# EAGLE design BBBMS rev 2 (EAGLE 6.3)

## Sheet 1 of 5
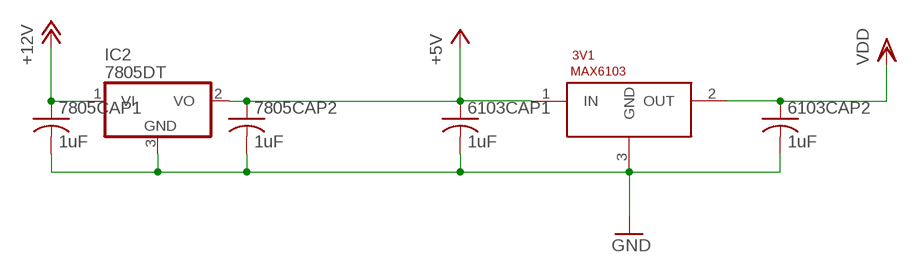
[diagram p0: schematic, sheet 1]

### Parts
3V1  MAX6103  [SOT23]
6103CAP1  1uF  C-USC1206  [C1206]
6103CAP2  1uF  C-USC1206  [C1206]
7805CAP1  1uF  C-USC1206  [C1206]
7805CAP2  1uF  C-USC1206  [C1206]
IC2  7805DT  [TO252]

### Nets
5V: 3V1.1(IN) 6103CAP1.1 7805CAP2.1 IC2.2(VO) ; supply symbol labelled +5V ; also sheet 5
12V: 7805CAP1.1 IC2.1(VI) ; supply symbol labelled +12V ; also sheet 2,3,4,5
GND: 3V1.3(GND) 6103CAP1.2 6103CAP2.2 7805CAP1.2 7805CAP2.2 IC2.3(GND) ; also sheet 2,3,4,5
VREF: 3V1.2(OUT) 6103CAP2.1 ; supply symbol labelled VDD ; also sheet 2,3

## Sheet 2 of 5
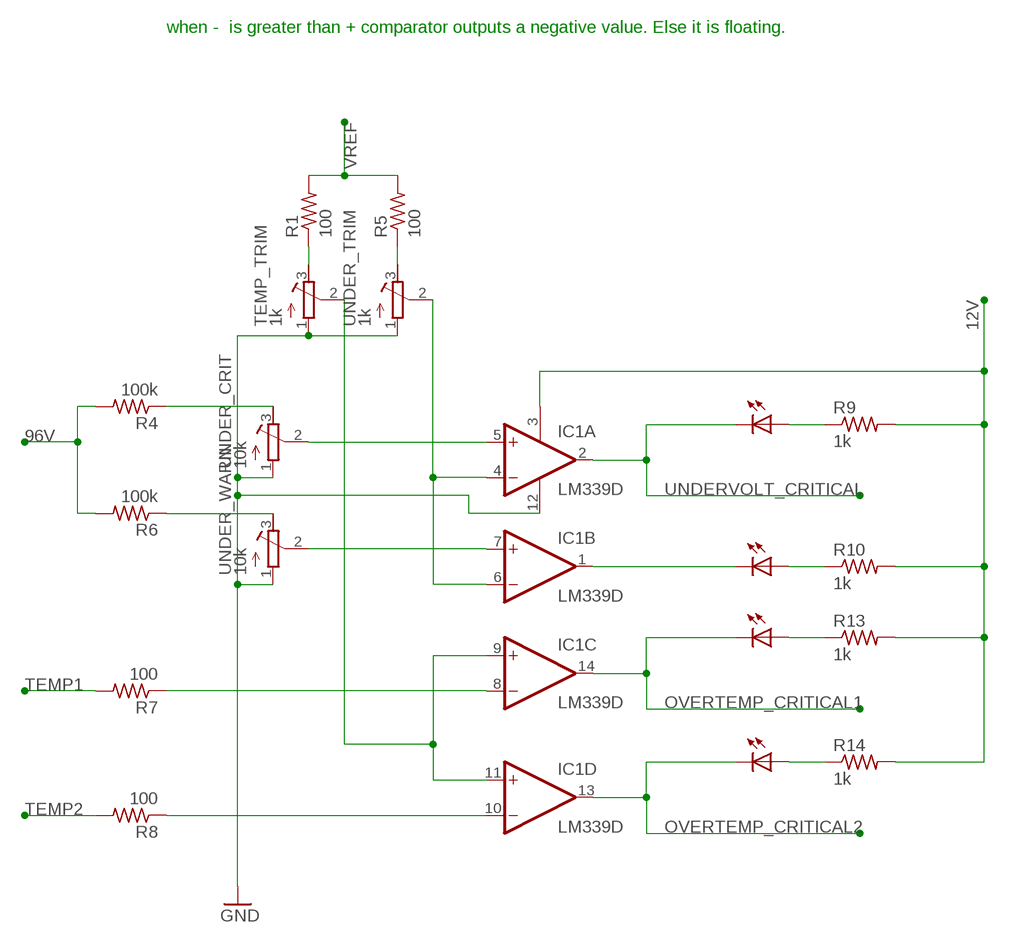
[diagram p1: schematic, sheet 2]

### Parts
IC1  LM339D  [SO14]
OVERTEMP1  LEDCHIPLED_1206  [CHIPLED_1206]
OVERTEMP2  LEDCHIPLED_1206  [CHIPLED_1206]
R1  100  R-US_R1206  [R1206]
R4  100k  R-US_R1206  [R1206]
R5  100  R-US_R1206  [R1206]
R6  100k  R-US_R1206  [R1206]
R7  100  R-US_R1206  [R1206]
R8  100  R-US_R1206  [R1206]
R9  1k  R-US_R1206  [R1206]
R10  1k  R-US_R1206  [R1206]
R13  1k  R-US_R1206  [R1206]
R14  1k  R-US_R1206  [R1206]
TEMP_TRIM  1k  R-TRIMMTS63Y  [RTRIMTS63Y]
UNDER_CRIT  10k  R-TRIMMTS63Y  [RTRIMTS63Y]
UNDER_TRIM  1k  R-TRIMMTS63Y  [RTRIMTS63Y]
UNDER_WARN  10k  R-TRIMMTS63Y  [RTRIMTS63Y]
UNDERVOLT  LEDCHIPLED_1206  [CHIPLED_1206]
UNDERVOLT_WARN  LEDCHIPLED_1206  [CHIPLED_1206]

### Nets
12V: IC1.3(P:V+) R9.2 R10.2 R13.2 R14.2 ; also sheet 1,3,4,5
96V: R4.2 R6.2 ; also sheet 3,5
GND: IC1.12(P:GND) TEMP_TRIM.1(A) UNDER_CRIT.1(A) UNDER_TRIM.1(A) UNDER_WARN.1(A) ; also sheet 1,3,4,5
N$2: IC1.8(C:-IN) R7.1
N$3: IC1.7(B:+IN) UNDER_WARN.2(S)
N$4: IC1.5(A:+IN) UNDER_CRIT.2(S)
N$5: IC1.9(C:+IN) IC1.11(D:+IN) TEMP_TRIM.2(S)
N$6: R6.1 UNDER_WARN.3(E)
N$8: IC1.10(D:-IN) R8.1
N$9: R4.1 UNDER_CRIT.3(E)
N$10: IC1.4(A:-IN) IC1.6(B:-IN) UNDER_TRIM.2(S)
N$11: R5.1 UNDER_TRIM.3(E)
N$12: R1.1 TEMP_TRIM.3(E)
N$14: R9.1 UNDERVOLT.A
N$15: R10.1 UNDERVOLT_WARN.A
N$16: OVERTEMP1.A R13.1
N$17: OVERTEMP2.A R14.1
OVERTEMP_CRITICAL1: IC1.14(C:OUT) OVERTEMP1.C ; also sheet 4
OVERTEMP_CRITICAL2: IC1.13(D:OUT) OVERTEMP2.C ; also sheet 4
TEMP1: R7.2 ; also sheet 5
TEMP2: R8.2 ; also sheet 5
UNDERVOLT_CRITICAL: IC1.2(A:OUT) UNDERVOLT.C ; also sheet 4
UNDERVOLT_WARNING: IC1.1(B:OUT) UNDERVOLT_WARN.C
VREF: R1.2 R5.2 ; also sheet 1,3

### Notes on the sheet
- when -  is greater than + comparator outputs a negative value. Else it is floating.

## Sheet 3 of 5
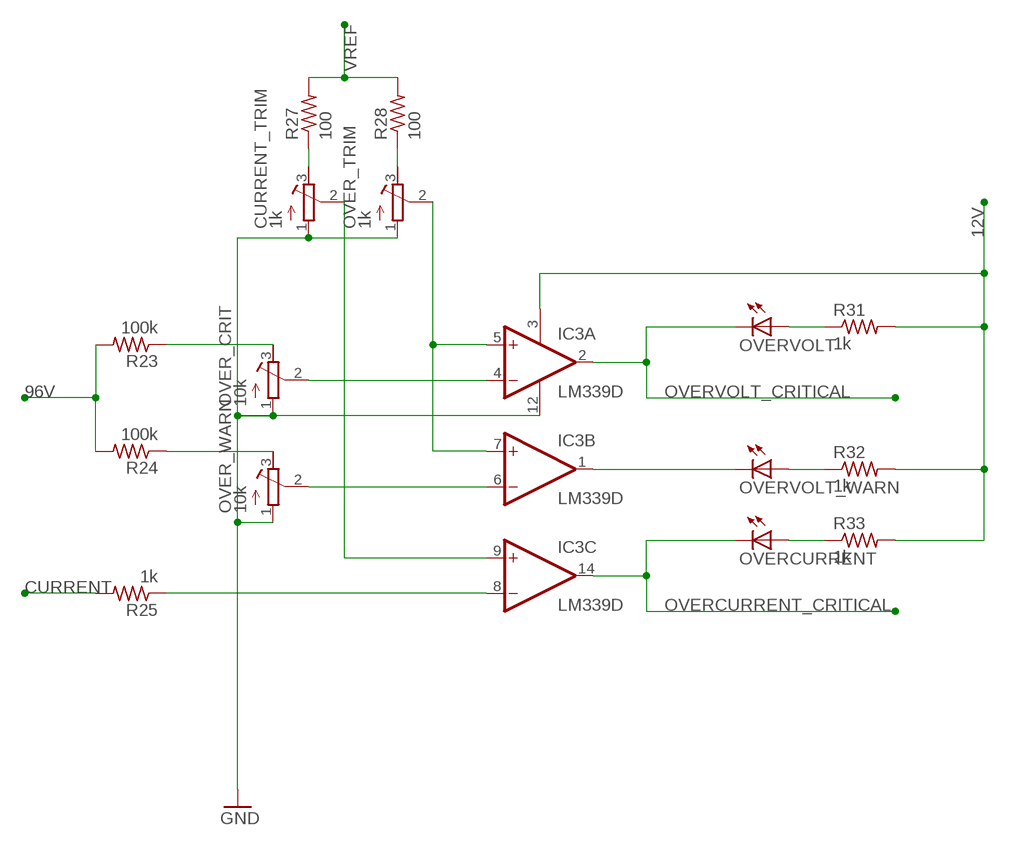
[diagram p2: schematic, sheet 3]

### Parts
CURRENT_TRIM  1k  R-TRIMMTS63Y  [RTRIMTS63Y]
IC3  LM339D  [SO14]
OVER_CRIT  10k  R-TRIMMTS63Y  [RTRIMTS63Y]
OVER_TRIM  1k  R-TRIMMTS63Y  [RTRIMTS63Y]
OVER_WARN  10k  R-TRIMMTS63Y  [RTRIMTS63Y]
OVERCURRENT  LEDCHIPLED_1206  [CHIPLED_1206]
OVERVOLT  LEDCHIPLED_1206  [CHIPLED_1206]
OVERVOLT_WARN  LEDCHIPLED_1206  [CHIPLED_1206]
R23  100k  R-US_R1206  [R1206]
R24  100k  R-US_R1206  [R1206]
R25  1k  R-US_R1206  [R1206]
R27  100  R-US_R1206  [R1206]
R28  100  R-US_R1206  [R1206]
R31  1k  R-US_R1206  [R1206]
R32  1k  R-US_R1206  [R1206]
R33  1k  R-US_R1206  [R1206]

### Nets
12V: IC3.3(P:V+) R31.2 R32.2 R33.2 ; also sheet 1,2,4,5
96V: R23.2 R24.2 ; also sheet 2,5
CURRENT: R25.2 ; also sheet 5
GND: CURRENT_TRIM.1(A) IC3.12(P:GND) OVER_CRIT.1(A) OVER_TRIM.1(A) OVER_WARN.1(A) ; also sheet 1,2,4,5
N$20: IC3.6(B:-IN) OVER_WARN.2(S)
N$21: IC3.4(A:-IN) OVER_CRIT.2(S)
N$22: CURRENT_TRIM.2(S) IC3.9(C:+IN)
N$23: OVER_CRIT.3(E) R23.1
N$24: OVER_WARN.3(E) R24.1
N$25: IC3.8(C:-IN) R25.1
N$27: IC3.5(A:+IN) IC3.7(B:+IN) OVER_TRIM.2(S)
N$28: OVER_TRIM.3(E) R28.1
N$29: CURRENT_TRIM.3(E) R27.1
N$30: OVERVOLT.A R31.1
N$31: OVERVOLT_WARN.A R32.1
N$32: OVERCURRENT.A R33.1
OVERCURRENT_CRITICAL: IC3.14(C:OUT) OVERCURRENT.C ; also sheet 4
OVERVOLT_CRITICAL: IC3.2(A:OUT) OVERVOLT.C ; also sheet 4
OVERVOLT_WARNING1: IC3.1(B:OUT) OVERVOLT_WARN.C
VREF: R27.2 R28.2 ; also sheet 1,2
Unconnected: IC3.10(D:-IN) IC3.11(D:+IN) IC3.13(D:OUT)

## Sheet 4 of 5
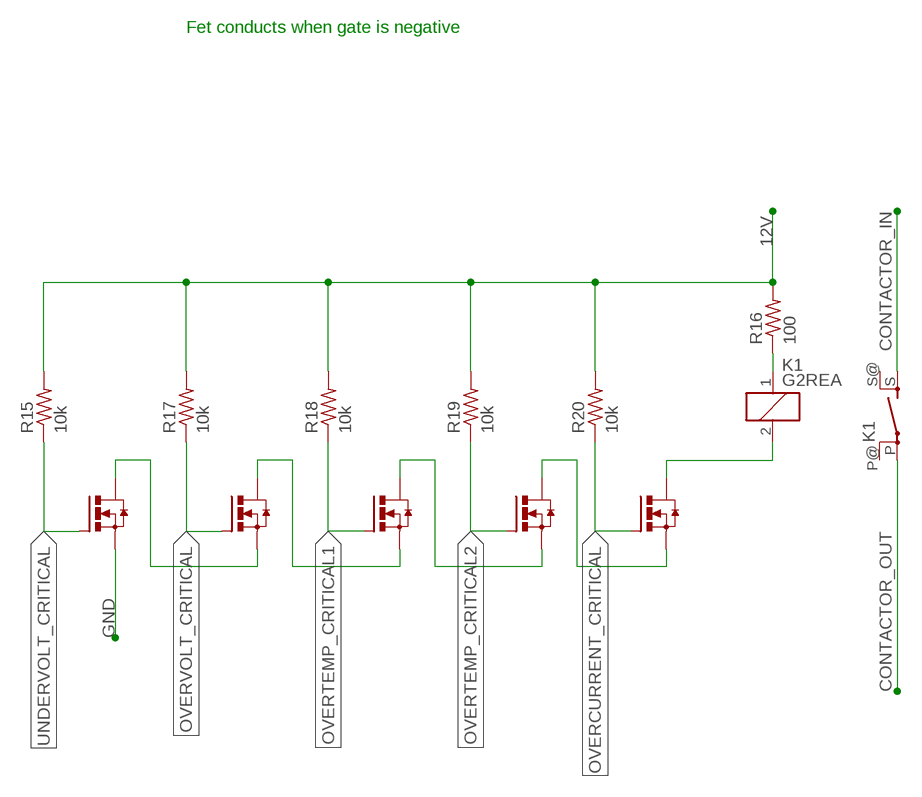
[diagram p3: schematic, sheet 4]

### Parts
K1  G2REA  [G2REA]
OVERCURRENT_FET  N-HEXFET-2D_SOT232-  [SOT223]
OVERTEMP1_FET  N-HEXFET-2D_SOT232-  [SOT223]
OVERTEMP2_FET  N-HEXFET-2D_SOT232-  [SOT223]
OVERVOLT_FET  N-HEXFET-2D_SOT232-  [SOT223]
R15  10k  R-US_R1206  [R1206]
R16  100  R-US_R1206  [R1206]
R17  10k  R-US_R1206  [R1206]
R18  10k  R-US_R1206  [R1206]
R19  10k  R-US_R1206  [R1206]
R20  10k  R-US_R1206  [R1206]
UNDERVOLT_FET  N-HEXFET-2D_SOT232-  [SOT223]

### Nets
12V: R15.2 R16.2 R17.2 R18.2 R19.2 R20.2 ; also sheet 1,2,3,5
CONTACTOR_IN: K1.S(2:S) ; also sheet 5
CONTACTOR_OUT: K1.P(2:P) ; also sheet 5
GND: UNDERVOLT_FET.3(S) ; also sheet 1,2,3,5
N$1: K1.2 OVERCURRENT_FET.2(D) OVERCURRENT_FET.4(D)
N$7: OVERCURRENT_FET.3(S) OVERTEMP2_FET.2(D) OVERTEMP2_FET.4(D)
N$13: K1.1 R16.1
N$18: OVERTEMP1_FET.2(D) OVERTEMP1_FET.4(D) OVERTEMP2_FET.3(S)
N$19: OVERTEMP1_FET.3(S) OVERVOLT_FET.2(D) OVERVOLT_FET.4(D)
N$26: OVERVOLT_FET.3(S) UNDERVOLT_FET.2(D) UNDERVOLT_FET.4(D)
OVERCURRENT_CRITICAL: OVERCURRENT_FET.1(G) R20.1 ; also sheet 3
OVERTEMP_CRITICAL1: OVERTEMP1_FET.1(G) R18.1 ; also sheet 2
OVERTEMP_CRITICAL2: OVERTEMP2_FET.1(G) R19.1 ; also sheet 2
OVERVOLT_CRITICAL: OVERVOLT_FET.1(G) R17.1 ; also sheet 3
UNDERVOLT_CRITICAL: R15.1 UNDERVOLT_FET.1(G) ; also sheet 2
Unconnected: K1.P@(2:P) K1.S@(2:S)

### Notes on the sheet
- Fet conducts when gate is negative

## Sheet 5 of 5
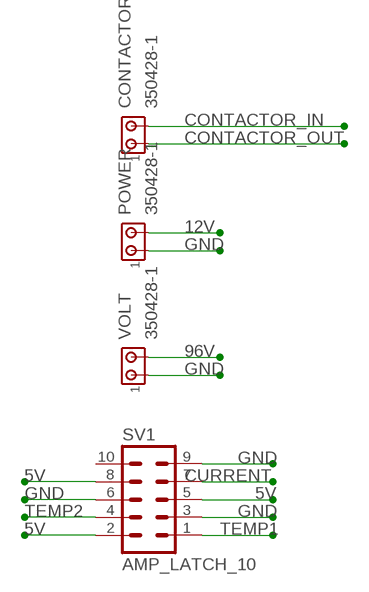
[diagram p4: schematic, sheet 5]

### Parts
CONTACTOR  350428-1  [350428-1]
POWER  350428-1  [350428-1]
SV1  AMP_LATCH_10  [MA05-2]
VOLT  350428-1  [350428-1]

### Nets
5V: SV1.2 SV1.5 SV1.8 ; also sheet 1
12V: POWER.2 ; also sheet 1,2,3,4
96V: VOLT.2 ; also sheet 2,3
CONTACTOR_IN: CONTACTOR.2 ; also sheet 4
CONTACTOR_OUT: CONTACTOR.1 ; also sheet 4
CURRENT: SV1.7 ; also sheet 3
GND: POWER.1 SV1.3 SV1.6 SV1.9 VOLT.1 ; also sheet 1,2,3,4
TEMP1: SV1.1 ; also sheet 2
TEMP2: SV1.4 ; also sheet 2
Unconnected: SV1.10

## Library data of the parts
3V1 = SolarJacketsADC:MAX6103
6103CAP1 6103CAP2 7805CAP1 7805CAP2 = rcl:C-US: CAPACITOR, American symbol
CONTACTOR POWER VOLT = con-amp:350428-1: Universal MATE-N-LOK .250" Centerline, 600 V, 19 - 36 A max Source: http://catalog.tycoelectronics.com/ .. ENG_CD_350428_Y.pdf
CURRENT_TRIM OVER_CRIT OVER_TRIM OVER_WARN TEMP_TRIM UNDER_CRIT UNDER_TRIM UNDER_WARN = rcl:R-TRIMM: Trimm resistor
IC1 IC3 = linear:LM339: Low Power Low Offset Voltage Quad Comparators with open collector; LM139/LM239/LM339/LM2901/LM3302
IC2 = linear:78*: Positive VOLTAGE REGULATOR Source: http://cache.national.com/ds/LM/LM78L05.pdf http://www.fairchildsemi.com/ds/LM/LM7805.pdf
K1 = relay:G2REA: RELAY 1 x norm. open, high current, Omron; OC_FARNELL: unknown; OC_NEWARK: unknown
OVERCURRENT OVERTEMP1 OVERTEMP2 OVERVOLT OVERVOLT_WARN UNDERVOLT UNDERVOLT_WARN = led:LED: LED OSRAM: - CHIPLED LG R971, LG N971, LY N971, LG Q971, LY Q971, LO R971, LY R971 LH N974, LH R974 LS Q976, LO Q976, LY Q976 LO Q996 - Hyper CHIPLED LW Q18S LB Q993, LB Q99A, LB R99A - SideLED LS A670, LO A670, LY A670, LG A670, LP A670 LB A673, LV A673, LT A673, LW A673 LH A674 LY A675 LS A676, LA A676, LO A676, LY A676, LW A676 LS A679, LY A679, LG A679 - Hyper Micro SIDELED® LS Y876, LA Y876, LO Y876, LY Y876 LT Y87S - SmartLED LW L88C, LW L88S LB L89C, LB L89S, LG L890 LS L89K, LO L89K, LY L89K LS L896, LA L896, LO L896, LY L896 - TOPLED LS T670, LO T670, LY T670, LG T670, LP T670 LSG T670, LSP T670, LSY T670, LOP T670, LYG T670 LG T671, LOG T671, LSG T671 LB T673, LV T673, LT T673, LW T673 LH T674 LS T676, LA T676, LO T676, LY T676, LB T676, LH T676, LSB T676, LW T676 LB T67C, LV T67C, LT T67C, LS T67K, LO T67K, LY T67K, LW E67C LS E67B, LA E67B, LO E67B, LY E67B, LB E67C, LV E67C, LT E67C LW T67C LS T679, LY T679, LG T679 LS T770, LO T770, LY T770, LG T770, LP T770 LB T773, LV T773, LT T773, LW T773 LH T774 LS E675, LA E675, LY E675, LS T675 LS T776, LA T776, LO T776, LY T776, LB T776 LHGB T686 LT T68C, LB T68C - Hyper Mini TOPLED® LB M676 - Mini TOPLED Santana® LG M470 LS M47K, LO M47K, LY M47K Source: http://www.osram.convergy.de LUXEON: - LUMILED® LXK2-PW12-R00, LXK2-PW12-S00, LXK2-PW14-U00, LXK2-PW14-V00 LXK2-PM12-R00, LXK2-PM12-S00, LXK2-PM14-U00 LXK2-PE12-Q00, LXK2-PE12-R00, LXK2-PE12-S00, LXK2-PE14-T00, LXK2-PE14-U00 LXK2-PB12-K00, LXK2-PB12-L00, LXK2-PB12-M00, LXK2-PB14-N00, LXK2-PB14-P00, LXK2-PB14-Q00 LXK2-PR12-L00, LXK2-PR12-M00, LXK2-PR14-Q00, LXK2-PR14-R00 LXK2-PD12-Q00, LXK2-PD12-R00, LXK2-PD12-S00 LXK2-PH12-R00, LXK2-PH12-S00 LXK2-PL12-P00, LXK2-PL12-Q00, LXK2-PL12-R00 Source: www.luxeon.com KINGBRIGHT: KA-3528ASYC Source: www.kingbright.com
OVERCURRENT_FET OVERTEMP1_FET OVERTEMP2_FET OVERVOLT_FET UNDERVOLT_FET = transistor-power:N-HEXFET-2D_?-*: HEXFET® Power MOSFET 2 Drain connects http://www.irf.com/product-info/datasheets/data/irll014n.pdf
R1 R4-R10 R13-R20 R23-R25 R27 R28 R31-R33 = rcl:R-US_: RESISTOR, American symbol
SV1 = SolarJacketsADC:AMP_LATCH_10; PART_NUM: 5499922-1

## Board
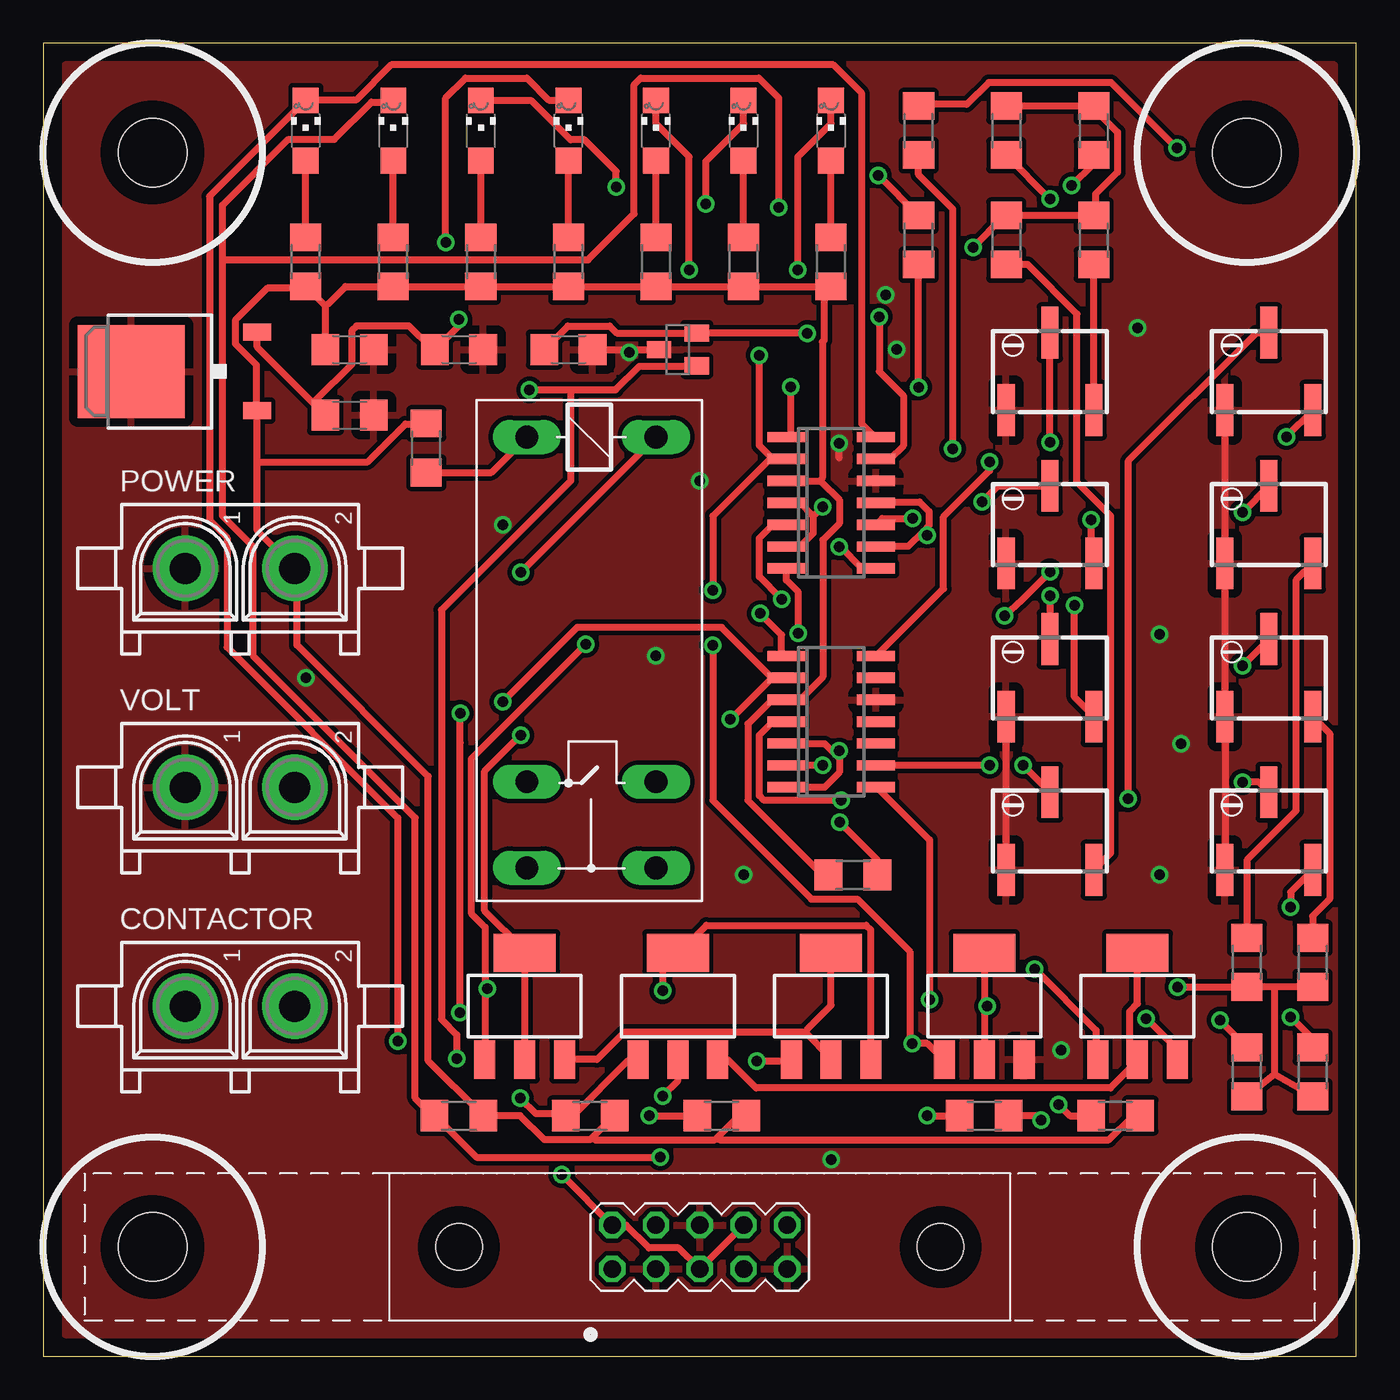
[diagram p5: board, top side]
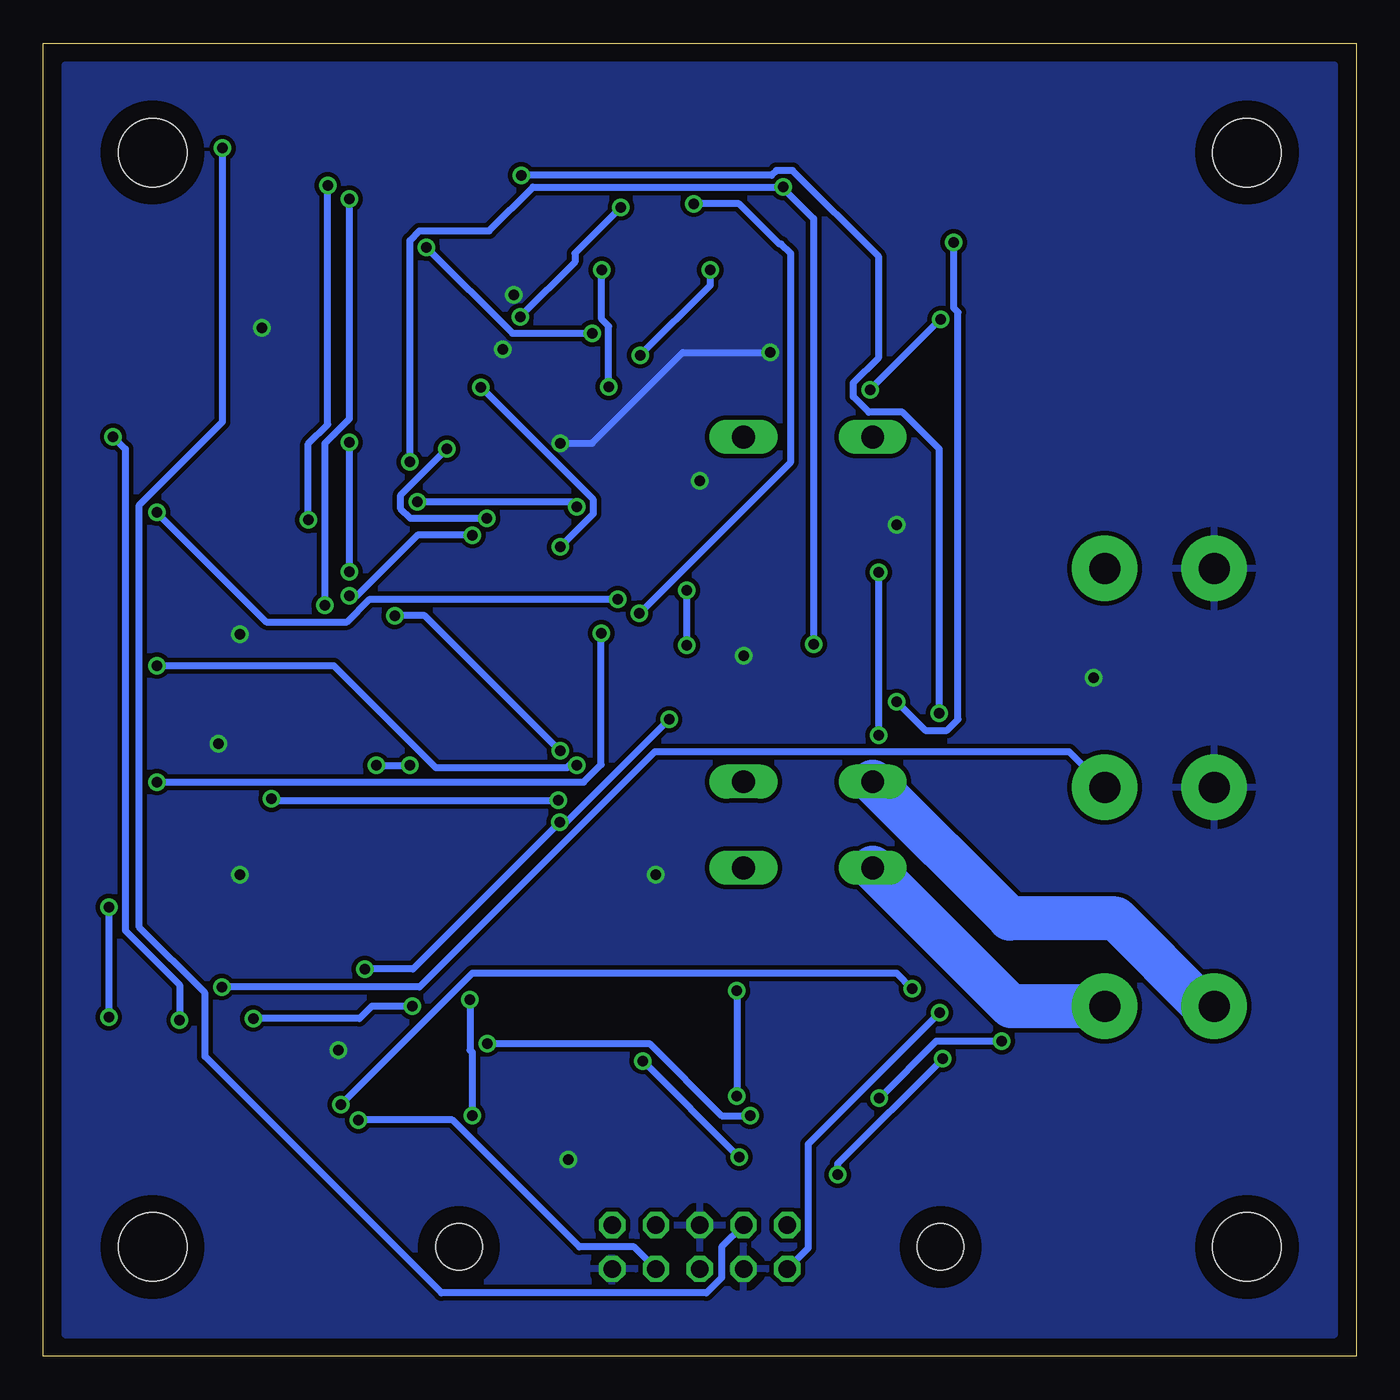
[diagram p6: board, bottom side, seen from below]

Size 76.2 x 76.2 mm. Coordinates in mm from the lower left corner, seen from the top.
Outline: 0,0 76.2,0 76.2,76.2 0,76.2 0,0
Copper layers (1*16): Top 0.035mm / dielectric 1.5mm / Bottom 0.035mm
Design rules "SJ Design Rules": minimum track width 16mil, minimum drill 24mil, track to track 10mil, track to pad 10mil, pad to pad 10mil, via to via 10mil, smd to smd 10mil, copper to edge 40mil, drill to drill 10mil, minimum pad ring 10mil, minimum via ring 8mil, stop-mask expansion 4mil, vias tented up to drill 0mil, thermal gap 20mil
Holes 3.97 mm at 6.35,6.35 69.85,69.85 6.35,69.85 69.85,6.35

### Footprints (pad centres in the part's own frame; a part is rotated, then mirrored left to right if it is on the bottom)
SOT23 = smd 1 x 1.4: 1 -0.95,-1.1; 2 0.95,-1.1; 3 0,1.1
C1206 = smd 1.6 x 1.8: 1 -1.4,0; 2 1.4,0
350428-1 = drill 1.8 pad 3.81: 1 -3.175,0; 2 3.175,0
RTRIMTS63Y = smd 1 x 3: 1 -2.55,-2.25; 2 0,2.25; 3 2.55,-2.25
SO14 = smd 0.6 x 2.2: 1 -3.81,-2.6; 2 -2.54,-2.6; 3 -1.27,-2.6; 4 0,-2.6; 5 1.27,-2.6; 6 2.54,-2.6; 7 3.81,-2.6; 8 3.81,2.6; 9 2.54,2.6; 10 1.27,2.6; 11 0,2.6; 12 -1.27,2.6; 13 -2.54,2.6; 14 -3.81,2.6
TO252 = smd 1 x 1.6: 1 -2.28,-4.8; 2 2.28,-4.8 | smd 5.4 x 6.2: 3 0,2.5
G2REA = drill 1.321 long: 1 -2.54,-3.683; 2 -2.54,3.81; P 17.45,-3.683; P@ 17.45,3.81; S 22.454,-3.683; S@ 22.454,3.81
CHIPLED_1206 = smd 1.5 x 1.5: A 0,-1.75; C 0,1.75
SOT223 = smd 1.219 x 2.235: 1 -2.311,-3.099; 2 0,-3.099; 3 2.311,-3.099 | smd 3.6 x 2.2: 4 0,3.099
R1206 = smd 1.6 x 1.803: 1 -1.422,0; 2 1.422,0
MA05-2 = drill 1.016 octagon: 1 -5.08,-1.27; 2 -5.08,1.27; 3 -2.54,-1.27; 4 -2.54,1.27; 5 0,-1.27; 6 0,1.27; 7 2.54,-1.27; 8 2.54,1.27; 9 5.08,-1.27; 10 5.08,1.27 | hole 2.692: -13.97,0; 13.97,0

### Placement (x,y rotation side)
3V1  36.83,58.42 90 top
6103CAP1  24.13,58.42 0 top
6103CAP2  30.48,58.42 0 top
7805CAP1  17.78,58.42 0 top
7805CAP2  17.78,54.61 0 top
CONTACTOR  11.43,20.32 0 top
CURRENT_TRIM  58.42,30.48 0 top
IC1  45.72,49.53 270 top
IC2  7.62,57.15 90 top
IC3  45.72,36.83 270 top
K1  31.75,50.8 270 top
OVER_CRIT  71.12,57.15 0 top
OVER_TRIM  58.42,57.15 0 top
OVER_WARN  71.12,39.37 0 top
OVERCURRENT  25.4,71.12 0 top
OVERCURRENT_FET  27.94,20.32 0 top
OVERTEMP1  15.24,71.12 0 top
OVERTEMP1_FET  36.83,20.32 0 top
OVERTEMP2  20.32,71.12 0 top
OVERTEMP2_FET  45.72,20.32 0 top
OVERVOLT  30.48,71.12 0 top
OVERVOLT_FET  63.5,20.32 0 top
OVERVOLT_WARN  40.64,71.12 0 top
POWER  11.43,45.72 0 top
R1  55.88,71.12 90 top
R4  69.85,22.86 270 top
R5  60.96,71.12 90 top
R6  73.66,16.51 270 top
R7  50.8,64.77 90 top
R8  50.8,71.12 90 top
R9  35.56,63.5 270 top
R10  45.72,63.5 270 top
R13  15.24,63.5 270 top
R14  20.32,63.5 270 top
R15  39.37,13.97 0 top
R16  22.23,52.7 90 top
R17  46.99,27.94 180 top
R18  31.75,13.97 0 top
R19  24.13,13.97 0 top
R20  62.23,13.97 0 top
R23  69.85,16.51 270 top
R24  73.66,22.86 270 top
R25  54.61,13.97 0 top
R27  55.88,64.77 90 top
R28  60.96,64.77 90 top
R31  30.48,63.5 270 top
R32  40.64,63.5 270 top
R33  25.4,63.5 270 top
SV1  38.1,6.35 0 top
TEMP_TRIM  58.42,39.37 0 top
UNDER_CRIT  71.12,48.26 0 top
UNDER_TRIM  58.42,48.26 0 top
UNDER_WARN  71.12,30.48 0 top
UNDERVOLT  35.56,71.12 0 top
UNDERVOLT_FET  54.61,20.32 0 top
UNDERVOLT_WARN  45.72,71.12 0 top
VOLT  11.43,33.02 0 top

### Tracks (layer width: path | path; a pad name or v marks a point on that pad's centre or on a via)
5V  (via drill 0.61)
  Top 0.406: SV1.8 SV1.5 36.88,6.3 35.15,6.3 33.83,7.62 SV1.2 v30.1,10.54 | IC2.2 12.42,59.41 12.42,58.55 16.36,54.61 7805CAP2.1 15.8,55.45 17.91,57.56 17.91,59.51 18.19,59.79 21.23,59.79 22.53,58.5 6103CAP1.1 24.13,59.82 v24.13,60.17 | v28.22,56.08 30.61,56.08 | 30.61,56.08 33.22,56.08 34.59,57.45 37.92,57.45 3V1.1 | v24,17.27 24,18.67 23.11,19.56 23.11,43.31 30.61,50.8 30.61,56.08
  Bottom 0.406: v24.13,60.17 v28.22,56.08 | v30.1,10.54 30.1,11.18 v24,17.27
12V
  Top 0.406: 12.42,51.89 12.42,47.9 POWER.2 14.73,45.59 14.73,41.27 22.35,33.66 22.35,17.14 25.4,14.1 R19.2 27.69,13.97 29.08,12.57 31.75,12.57 31.88,12.7 | 12.42,51.89 IC2.1 12.37,55.07 12.37,57.53 11.15,58.75 11.15,60.12 13.01,61.98 15.06,61.98 R13.2 | 12.42,51.89 18.82,51.89 21.03,54.1 22.23,54.1 R16.2 | 45.11,50.8 46.2,49.71 46.2,48.34 45.24,47.37 45.24,39.42 43.92,38.1 IC3.3 42.29,38.1 40.89,36.7 40.89,32.26 45.21,27.94 R17.2 | IC1.3 45.11,50.8 | 16.36,60.96 16.36,58.42 7805CAP1.1 | R13.2 16.36,60.96 | R13.2 | R14.2 17.55,62.08 16.54,61.06 16.36,60.96 | R14.2 | R33.2 20.5,62.08 R14.2 | R33.2 | R31.2 25.58,62.08 R33.2 | R31.2 | R9.2 30.66,62.08 R31.2 | R9.2 | R32.2 35.74,62.08 R9.2 | R32.2 | R10.2 40.82,62.08 R32.2 | R10.2 | 45.11,50.8 45.21,50.98 45.21,58.85 45.31,58.95 45.31,61.9 R10.2 | 31.88,12.7 33.15,13.97 R18.2 | R15.2 40.39,13.97 39.12,12.7 | 39.12,12.7 38.99,12.57 32,12.57 31.88,12.7 | R20.2 63.25,13.97 61.85,12.57 39.24,12.57 39.12,12.7
96V  (via drill 0.61)
  Top 0.406: R6.2 71.42,16.36 | 71.42,16.36 R23.2 | R23.2 | R6.2 | R24.2 71.42,21.44 | 71.42,21.44 R4.2 | R4.2 | R24.2 | 71.42,21.44 71.42,16.36 | v65.84,21.44 69.67,21.44 R4.2
  Bottom 0.406: v65.84,21.44 54.36,21.44 40.72,35.08 16.66,35.08 VOLT.2
CONTACTOR_IN
  Bottom 2.54: CONTACTOR.2 20.04,20.32 K1.S
CONTACTOR_OUT
  Bottom 2.54: CONTACTOR.1 8.89,20.32 13.97,25.4 20.12,25.4 K1.P
CURRENT  (via drill 0.61)
  Top 0.406: R25.2 57.66,13.97 v57.91,13.72
  Bottom 0.406: v57.91,13.72 52.45,13.72 45.09,6.35 41.91,6.35 SV1.7
GND  (via drill 0.61)
  Top 0.406: 6103CAP2.2 34.01,58.42 | 34.01,58.42 3V1.3 | UNDER_WARN.1 68.58,28.25 OVER_WARN.1 68.58,37.31 UNDER_CRIT.1 68.58,46.2 OVER_CRIT.1 | 55.85,46 UNDER_TRIM.1 | 55.85,37.41 TEMP_TRIM.1 55.88,36.93 55.88,28.42 CURRENT_TRIM.1 | 46.18,52.15 v46.18,52.98 | 47.45,50.88 48.13,50.88 IC1.12 | v34.01,58.24 34.01,58.42
  Bottom 0.406: 43.33,5.21 SV1.9 | v34.01,58.24 39.09,58.24 44.35,52.98 v46.18,52.98
  other vias: 38.1,50.8 35.56,40.64 40.64,27.94 64.77,27.94 63.5,59.69 48.9,61.59 15.24,39.37 45.72,11.43 66.04,35.56 64.77,41.91 26.67,48.26 59.05,17.78 49.53,58.42
  pour Top: 1.27,74.93 1.27,1.27 74.93,1.27 74.93,74.93
  pour Bottom: 1.27,74.93 74.93,74.93 74.93,1.27 1.27,1.27
N$1  (via drill 0.61)
  Top 0.406: OVERCURRENT_FET.2 OVERCURRENT_FET.4 27.86,23.62 25.63,25.86 25.63,33.96 v27.71,36.04 | v27.71,45.49 K1.2
  Bottom 0.406: v27.71,36.04 v27.71,45.49
N$2  (via drill 0.61)
  Top 0.406: v50.8,56.24 R7.1 | v46.2,46.97 46.28,46.97 47.52,45.72 IC1.8
  Bottom 0.406: v50.8,56.24 44.27,49.71 44.27,48.9 v46.2,46.97
N$3  (via drill 0.61)
  Top 0.406: v43.81,41.96 43.81,44.35 43.13,45.03 IC1.7 | v69.6,33.33 70.54,33.33 UNDER_WARN.2
  Bottom 0.406: v43.81,41.96 43.81,34.34 44.83,33.33 v69.6,33.33
N$4  (via drill 0.61)
  Top 0.406: IC1.5 42.34,48.26 41.55,47.47 41.55,45.24 v42.85,43.94 | v69.6,48.97 71.12,50.49 UNDER_CRIT.2
  Bottom 0.406: v42.85,43.94 57.25,43.94 58.57,42.62 63.25,42.62 v69.6,48.97
N$5  (via drill 0.61)
  Top 0.406: IC1.9 50.19,46.99 51.07,47.87 | 51.07,47.87 51.41,48.21 51.41,49.02 50.85,49.58 48.39,49.58 48.34,49.53 IC1.11 | v58.42,44.15 TEMP_TRIM.2 | v51.28,47.65 51.07,47.87
  Bottom 0.406: v58.42,44.15 57.99,44.15 54.48,47.65 v51.28,47.65
N$6  (via drill 0.61)
  Top 0.406: R6.1 73.66,18.41 v72.39,19.68 | v72.39,26.06 72.39,26.95 UNDER_WARN.3
  Bottom 0.406: v72.39,26.06 v72.39,19.68
N$7
  Top 0.406: OVERCURRENT_FET.3 32.13,17.22 33.71,18.8 44.22,18.8 | 44.22,18.8 45.72,17.3 OVERTEMP2_FET.2 | OVERCURRENT_FET.3 | OVERTEMP2_FET.4 45.72,20.37 44.32,18.97 44.22,18.8
N$8  (via drill 0.61)
  Top 0.406: R8.1 50.8,68.56 52.78,66.57 v52.78,52.65 | v50.44,48.62 48.69,48.62 48.34,48.26 IC1.10
  Bottom 0.406: v52.78,52.65 55.45,49.99 55.45,49.17 54.89,48.62 v50.44,48.62
N$9
  Top 0.406: R4.1 69.85,28.8 72.69,31.65 72.69,45.03 UNDER_CRIT.3
N$10  (via drill 0.61)
  Top 0.406: IC1.6 43.92,46.99 44.68,47.75 44.68,48.77 | 44.68,48.77 43.92,49.53 IC1.4 | v54.48,49.58 55.4,50.49 58.42,50.49 UNDER_TRIM.2 | v45.24,49.3 44.83,48.9 44.68,48.77
  Bottom 0.406: v54.48,49.58 45.52,49.58 v45.24,49.3
N$11  (via drill 0.61)
  Top 0.406: R5.1 60.96,69.22 v59.69,67.94 | v60.81,48.54 60.81,46.18 60.96,46.02 UNDER_TRIM.3
  Bottom 0.406: v59.69,67.94 59.69,54.08 60.81,52.96 v60.81,48.54
N$12  (via drill 0.61)
  Top 0.406: v58.42,67.16 R1.1 | v59.84,43.59 59.84,38.25 60.96,37.13 TEMP_TRIM.3 | R1.1
  Bottom 0.406: v58.42,67.16 58.42,54.41 59.84,52.98 v59.84,43.59
N$13
  Top 0.406: R16.1 26.01,51.28 K1.1
N$14
  Top 0.406: R9.1 UNDERVOLT.A
N$15
  Top 0.406: R10.1 UNDERVOLT_WARN.A
N$16
  Top 0.406: R13.1 OVERTEMP1.A
N$17
  Top 0.406: R14.1 OVERTEMP2.A
N$18  (via drill 0.61)
  Top 0.406: OVERTEMP1_FET.2 36.83,16 v35.94,15.11 | v35.94,21.21 35.94,22.48 36.83,23.37 OVERTEMP1_FET.4 36.96,23.5 38.48,25.02 47.75,25.02 48.01,24.77 48.01,17.27 OVERTEMP2_FET.3
  Bottom 0.406: v35.94,21.21 v35.94,15.11
N$19
  Top 0.406: OVERTEMP1_FET.3 39.14,17.2 39.75,17.2 41.38,15.57 61.92,15.57 63.5,17.14 OVERVOLT_FET.2 63.04,16.97 63.04,20.02 63.5,20.47 OVERVOLT_FET.4
N$20  (via drill 0.61)
  Top 0.406: v45.24,34.29 IC3.6 | v69.6,40.08 71.12,41.6 OVER_WARN.2
  Bottom 0.406: v45.24,34.29 45.67,34.29 45.8,34.16 53.42,34.16 59.33,40.08 v69.6,40.08
N$21  (via drill 0.61)
  Top 0.406: IC3.4 42.34,36.83 41.55,36.04 41.55,32.54 41.83,32.26 v46.3,32.26 | v62.94,32.36 62.94,51.94 70.38,59.38 71.12,59.38 OVER_CRIT.2
  Bottom 0.406: v46.3,32.26 62.84,32.26 v62.94,32.36
N$22  (via drill 0.61)
  Top 0.406: v54.91,34.29 IC3.9 | v56.87,34.29 CURRENT_TRIM.2
  Bottom 0.406: v56.87,34.29 v54.91,34.29
N$23  (via drill 0.61)
  Top 0.406: v68.28,19.51 R23.1 | v72.14,53.37 OVER_CRIT.3 | R23.1
  Bottom 0.406: v68.28,19.51 68.28,21.57 71.42,24.71 71.42,52.65 v72.14,53.37
N$24
  Top 0.406: R24.1 73.66,25.55 74.65,26.54 74.65,36.14 73.69,37.11 OVER_WARN.3
N$25  (via drill 0.61)
  Top 0.406: v51.31,13.97 R25.1 | v51.44,20.7 51.44,29.97 48.39,33.02 IC3.8
  Bottom 0.406: v51.31,13.97 51.31,17.65 51.44,17.78 v51.44,20.7
N$26  (via drill 0.61)
  Top 0.406: UNDERVOLT_FET.4 54.61,20.32 | 54.61,20.32 UNDERVOLT_FET.2 | v64.01,19.61 65.79,17.83 65.79,17.22 OVERVOLT_FET.3 | v54.79,20.32 54.61,20.32
  Bottom 0.406: v64.01,19.61 57.84,19.61 57.12,20.32 v54.79,20.32
N$27  (via drill 0.61)
  Top 0.406: IC3.7 45.34,33.02 46.2,33.88 46.2,34.7 45.99,34.91 | 45.99,34.91 45.34,35.56 IC3.5 | v58.42,53.03 OVER_TRIM.2 | v58.42,45.52 56.82,43.92 v55.8,42.98 | v46.2,35.13 45.99,34.91
  Bottom 0.406: v58.42,45.52 v58.42,53.03 | v55.8,42.98 54.05,42.98 v46.2,35.13
N$28
  Top 0.406: R28.1 60.96,54.91 OVER_TRIM.3
N$29
  Top 0.406: R27.1 57.12,63.35 59.99,60.48 59.99,50.72 61.95,48.77 61.95,29.21 60.98,28.25 CURRENT_TRIM.3 | R27.1
N$30
  Top 0.406: R31.1 OVERVOLT.A
N$31
  Top 0.406: R32.1 OVERVOLT_WARN.A
N$32
  Top 0.406: R33.1 OVERCURRENT.A
OVERCURRENT_CRITICAL  (via drill 0.61)
  Top 0.406: v33.25,67.84 33.25,68.76 31.42,70.59 30.61,70.59 28.35,72.85 25.4,72.85 OVERCURRENT.C | v54.91,51.89 54.91,51.38 52.25,48.72 52.25,44.55 48.34,40.64 IC3.14 | 25.65,21.34 25.65,24.89 24.84,25.7 24.84,34.67 v31.5,41.33 | 25.65,21.34 25.65,17.4 OVERCURRENT_FET.1 | R20.1 59.56,13.97 v58.93,14.61 | v25.78,21.34 25.65,21.34
  Bottom 0.406: v54.91,51.89 54.91,64.75 54.36,65.3 50.32,65.3 47.78,67.84 v33.25,67.84 33.15,67.67 31.5,66.02 v31.5,41.33 | v58.93,14.61 51.31,22.23 26.67,22.23 v25.78,21.34
OVERTEMP_CRITICAL1  (via drill 0.61)
  Top 0.406: OVERTEMP1_FET.1 34.42,17.14 33.91,17.14 30.73,13.97 R18.1 30.23,14.1 28.57,14.1 v27.69,14.99 | IC1.14 48.26,53.34 47.5,54.1 47.5,73.28 45.85,74.93 20.19,74.93 18.16,72.9 15.24,72.9 OVERTEMP1.C 15.11,72.77 9.65,67.31 9.65,48.51 10.67,47.5 10.67,41.15 20.57,31.24 v20.57,18.29
  Bottom 0.406: v27.69,14.99 24.38,18.29 v20.57,18.29
OVERTEMP_CRITICAL2  (via drill 0.61)
  Top 0.406: 10.41,63.63 10.41,48.77 12.19,46.99 12.19,40.64 21.59,31.24 21.59,14.99 22.61,13.97 R19.1 22.86,13.84 25.15,11.56 v35.81,11.56 | 10.41,63.63 10.41,66.8 14.22,70.61 16.89,70.61 19.05,72.77 20.32,72.77 OVERTEMP2.C | IC1.13 49.15,52.07 49.91,52.83 49.91,55.75 48.51,57.15 v48.51,60.33 | v42.67,66.67 42.67,73.03 41.53,74.17 34.67,74.17 34.29,73.79 34.29,66.29 31.62,63.63 10.41,63.63 | v41.4,17.14 43.31,17.14 OVERTEMP2_FET.1
  Bottom 0.406: v48.51,60.33 45.34,63.5 45.34,64.01 v42.67,66.67 | v35.81,11.56 v41.4,17.14
OVERVOLT_CRITICAL  (via drill 0.61)
  Top 0.406: v23.37,64.64 23.37,73.03 24.51,74.17 28.07,74.17 29.34,72.9 30.48,72.9 OVERVOLT.C | v26.67,37.97 30.99,42.29 39.37,42.29 42.29,39.37 IC3.2 42.16,39.24 v39.88,36.96 | v46.23,30.99 48.39,28.83 48.39,27.94 R17.1 | v57.53,22.48 61.09,18.92 61.09,17.27 OVERVOLT_FET.1
  Bottom 0.406: v23.37,64.64 23.37,60.83 23.11,60.58 23.11,36.96 23.75,36.32 25.02,36.32 v26.67,37.97 | v39.88,36.96 45.85,30.99 v46.23,30.99 54.74,22.48 v57.53,22.48
OVERVOLT_WARNING1  (via drill 0.61)
  Top 0.406: OVERVOLT_WARN.C 40.64,71.53 38.46,69.34 v38.46,66.88 | v41.6,43.1 42.85,41.86 42.85,40.89 43.1,40.64 IC3.1
  Bottom 0.406: v38.46,66.88 35.81,66.88 33.48,64.54 33.38,64.54 32.82,63.98 32.82,51.89 v41.6,43.1
TEMP1  (via drill 0.61)
  Top 0.406: v48.46,68.53 R7.2 | v24.21,37.31 24.21,35.61 24.18,34.95 v24.18,19.94 | R7.2
  Bottom 0.406: v48.46,68.53 33.93,68.53 33.66,68.81 32.72,68.81 27.71,63.8 27.71,57.96 29.18,56.49 29.18,55.68 28.3,54.79 26.34,54.79 24.21,52.65 v24.21,37.31 | v24.18,19.94 31.8,12.32 31.8,6.3 SV1.1
TEMP2  (via drill 0.61)
  Top 0.406: v65.79,70.1 61.98,73.91 54.86,73.91 53.59,72.64 50.8,72.64 R8.2
  Bottom 0.406: v65.79,70.1 65.79,54.23 70.61,49.4 70.61,24.89 66.8,21.08 66.8,17.4 53.09,3.68 37.72,3.68 36.83,4.57 36.83,6.35 SV1.4
UNDERVOLT_CRITICAL  (via drill 0.61)
  Top 0.406: UNDERVOLT.C 35.56,71.53 37.49,69.6 v37.49,63.04 | v41.55,58.09 41.55,52.86 42.34,52.07 IC1.2 42.16,52.07 38.86,48.77 v38.86,44.45 | v35.18,13.97 R15.1 | UNDERVOLT_FET.1 52.2,17.27 51.31,18.16 v50.42,18.16 50.29,18.29 50.29,23.5 47.24,26.54 44.58,26.54 38.86,32.26 v38.86,41.27
  Bottom 0.406: v37.49,63.04 37.49,62.15 v41.55,58.09 | v35.18,13.97 36.83,13.97 41.02,18.16 v50.42,18.16 | v38.86,44.45 v38.86,41.27
UNDERVOLT_WARNING  (via drill 0.61)
  Top 0.406: UNDERVOLT_WARN.C 45.72,71.53 43.79,69.6 v43.79,63.04 | v43.38,56.26 43.38,53.59 IC1.1
  Bottom 0.406: v43.79,63.04 43.79,60.17 43.38,59.77 v43.38,56.26
VREF  (via drill 0.61)
  Top 0.406: 6103CAP2.1 30.45,59.79 32.87,59.79 33.27,59.38 37.92,59.38 3V1.2 38.12,59.36 v44.35,59.36 | R28.2 R27.2 | R27.2 | R28.2 | R5.2 R1.2 | R1.2 | R5.2 | R28.2 61.06,66.37 61.06,67.44 62.33,68.71 62.33,71.04 61.04,72.34 R5.2 | v53.95,64.34 55.7,66.09 R27.2
  Bottom 0.406: v44.35,59.36 48.97,59.36 v53.95,64.34

### Text on the board
tValues: Over Temp 1 | Over Temp 2 | Over Current | Over Voltage | Under Voltage | Over Volt Warn | Under Volt Warn | Over Volt Limit | Over Volt Critical | Under Volt Limit | Under Volt Critical | Temp Limit | Over Volt Warn | GND | 12V | Current Limit | Under Volt Warn | GND | 96V | NDT3055 | Pinout: / 1: Temp 1 / 2: 5V / 3: GND / 4: Temp 2 / 5: 5v / 6: GND / 7: Current / 8: 5V / 9: GND
bValues: Solar Jackets Bare Bones BMS / 11/29/12 REV 2